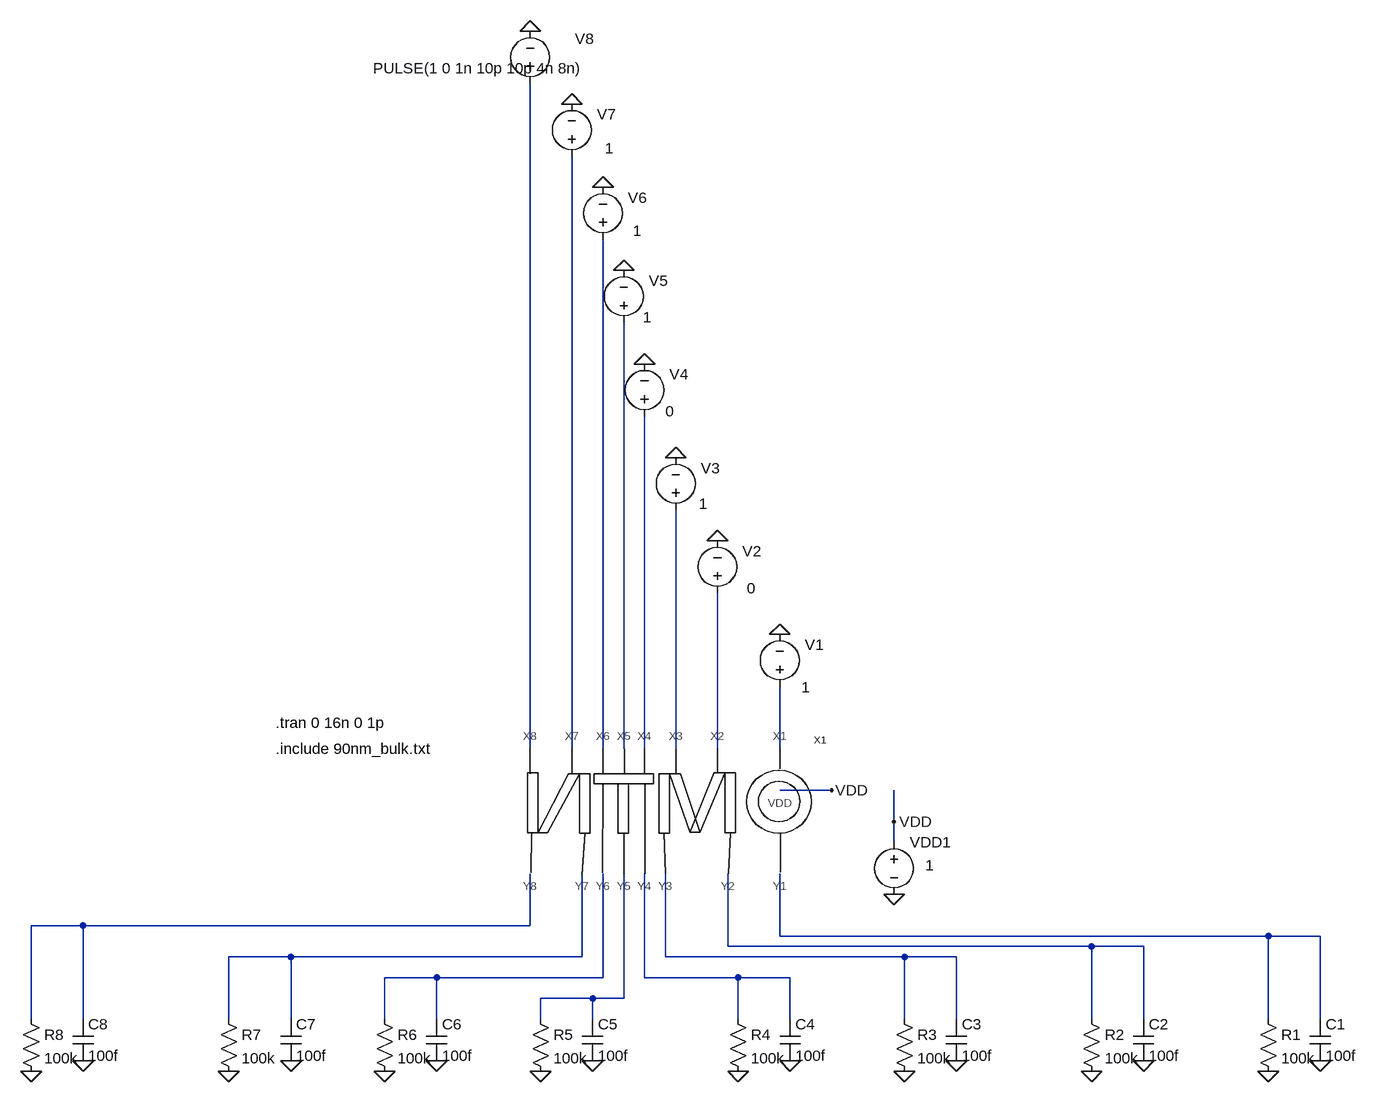
[diagram p0: schematic BCD_2_BIN_test.asc]
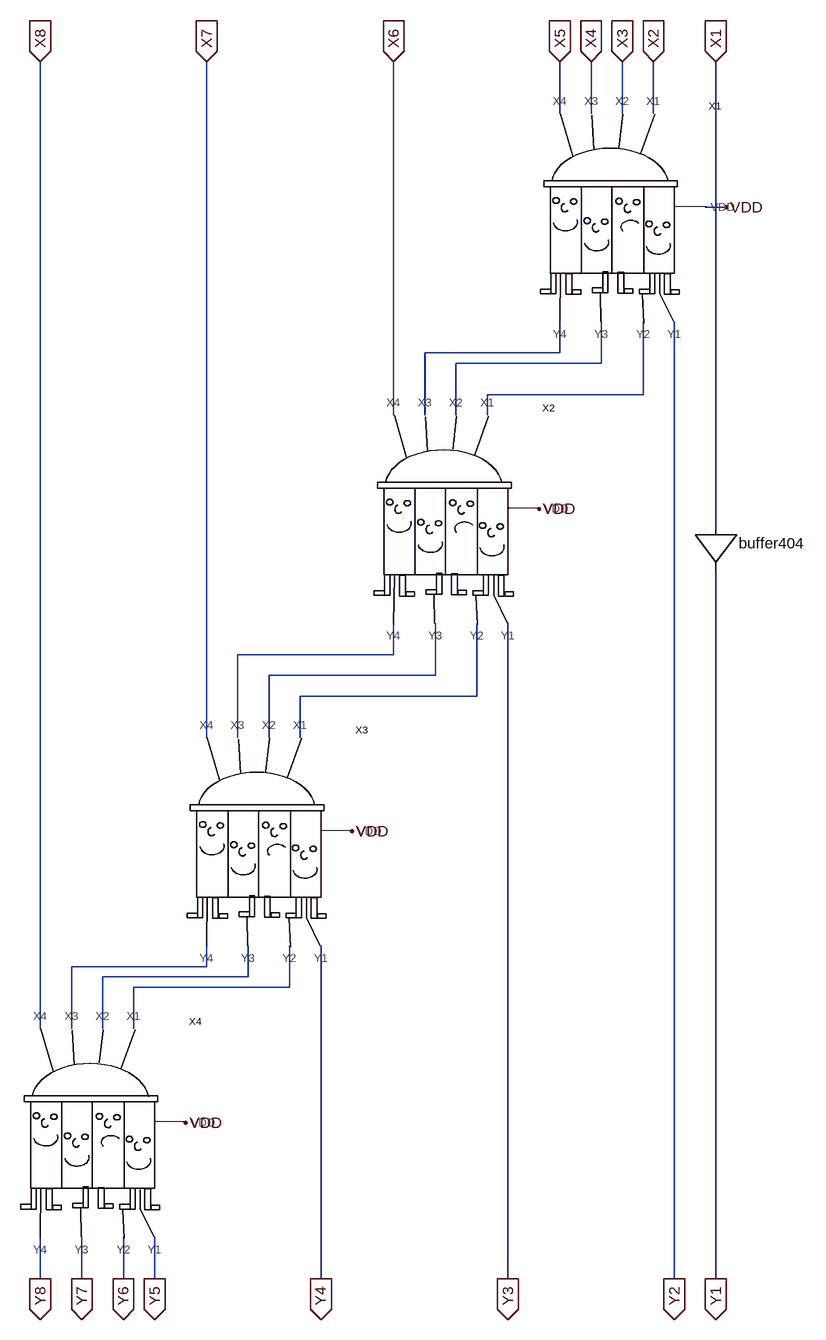
[diagram p1: sub-circuit bcd_2_bin.asc]
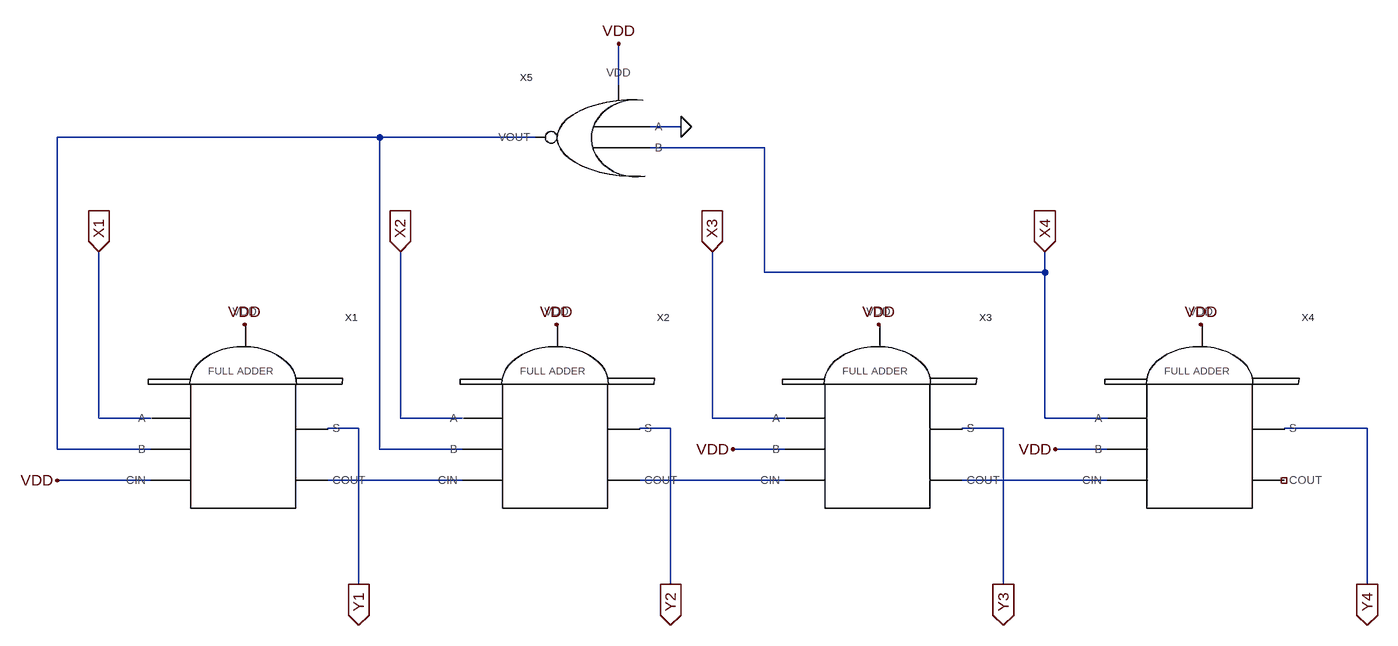
[diagram p2: sub-circuit func_block.asc]
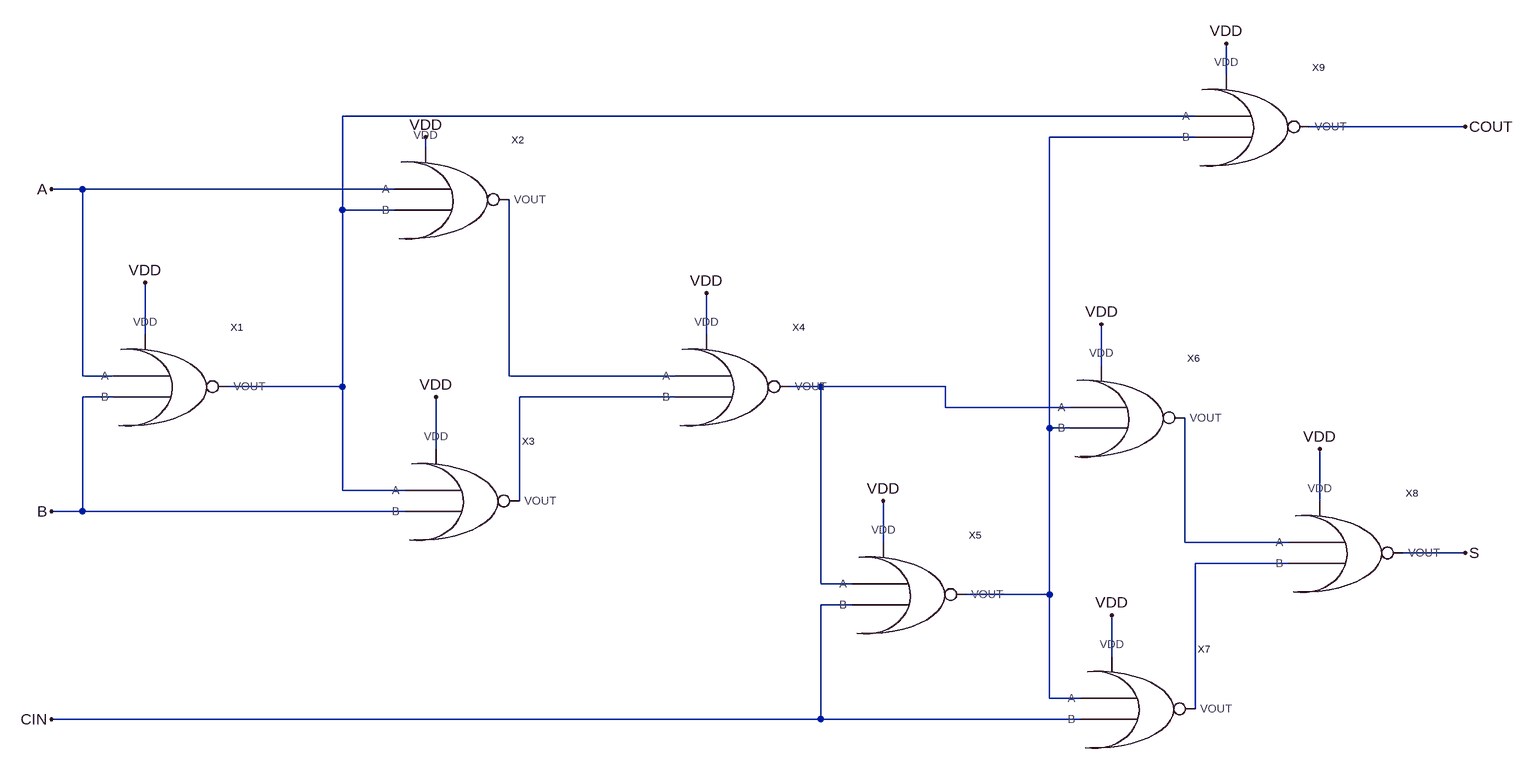
[diagram p3: sub-circuit adder.asc]
BCD_2_BIN_test.asc, the LTspice schematic file:
Version 4
SHEET 1 1356 980
WIRE 80 96 80 -928
WIRE 144 96 144 -816
WIRE 192 96 192 -688
WIRE 224 96 224 -560
WIRE 256 96 256 -416
WIRE 304 96 304 -272
WIRE 368 96 368 -144
WIRE 464 96 464 0
WIRE 544 160 464 160
WIRE 640 208 640 160
WIRE 640 240 640 208
WIRE -608 368 -688 368
WIRE 80 368 80 288
WIRE 80 368 -608 368
WIRE 464 384 464 288
WIRE 1216 384 464 384
WIRE 1296 384 1216 384
WIRE 384 400 384 288
WIRE 944 400 384 400
WIRE 1024 400 944 400
WIRE -288 416 -384 416
WIRE 160 416 160 288
WIRE 160 416 -288 416
WIRE 288 416 288 288
WIRE 656 416 288 416
WIRE 736 416 656 416
WIRE -64 448 -144 448
WIRE 192 448 192 288
WIRE 192 448 -64 448
WIRE 256 448 256 288
WIRE 400 448 256 448
WIRE 480 448 400 448
WIRE 176 480 96 480
WIRE 224 480 224 288
WIRE 224 480 176 480
WIRE -688 512 -688 368
WIRE -608 512 -608 368
WIRE -384 512 -384 416
WIRE -288 512 -288 416
WIRE -144 512 -144 448
WIRE -64 512 -64 448
WIRE 96 512 96 480
WIRE 176 512 176 480
WIRE 400 512 400 448
WIRE 480 512 480 448
WIRE 656 512 656 416
WIRE 736 512 736 416
WIRE 944 512 944 400
WIRE 1024 512 1024 400
WIRE 1216 512 1216 384
WIRE 1296 512 1296 384
FLAG 640 320 0
FLAG 640 208 VDD
FLAG 1296 576 0
FLAG 1216 592 0
FLAG 1024 576 0
FLAG 944 592 0
FLAG 736 576 0
FLAG 656 592 0
FLAG 480 576 0
FLAG 400 592 0
FLAG 176 576 0
FLAG 96 592 0
FLAG -64 576 0
FLAG -144 592 0
FLAG -288 576 0
FLAG -384 592 0
FLAG -608 576 0
FLAG -688 592 0
FLAG 464 -80 0
FLAG 368 -224 0
FLAG 304 -352 0
FLAG 256 -496 0
FLAG 224 -640 0
FLAG 192 -768 0
FLAG 144 -896 0
FLAG 80 -1008 0
FLAG 544 160 VDD
SYMBOL voltage 640 224 R0
WINDOW 3 48 51 Left 2
WINDOW 123 0 0 Left 0
WINDOW 39 0 0 Left 0
SYMATTR Value 1
SYMATTR InstName VDD1
SYMBOL BCD_2_BIN 272 176 R0
SYMATTR InstName X1
SYMBOL res 1200 496 R0
SYMATTR InstName R1
SYMATTR Value 100k
SYMBOL res 928 496 R0
SYMATTR InstName R2
SYMATTR Value 100k
SYMBOL res 640 496 R0
SYMATTR InstName R3
SYMATTR Value 100k
SYMBOL res 384 496 R0
SYMATTR InstName R4
SYMATTR Value 100k
SYMBOL res 80 496 R0
SYMATTR InstName R5
SYMATTR Value 100k
SYMBOL res -160 496 R0
SYMATTR InstName R6
SYMATTR Value 100k
SYMBOL res -400 496 R0
SYMATTR InstName R7
SYMATTR Value 100k
SYMBOL res -704 496 R0
SYMATTR InstName R8
SYMATTR Value 100k
SYMBOL cap 1280 512 R0
SYMATTR InstName C1
SYMATTR Value 100f
SYMBOL cap 1008 512 R0
SYMATTR InstName C2
SYMATTR Value 100f
SYMBOL cap 720 512 R0
SYMATTR InstName C3
SYMATTR Value 100f
SYMBOL cap 464 512 R0
SYMATTR InstName C4
SYMATTR Value 100f
SYMBOL cap 160 512 R0
SYMATTR InstName C5
SYMATTR Value 100f
SYMBOL cap -80 512 R0
SYMATTR InstName C6
SYMATTR Value 100f
SYMBOL cap -304 512 R0
SYMATTR InstName C7
SYMATTR Value 100f
SYMBOL cap -624 512 R0
SYMATTR InstName C8
SYMATTR Value 100f
SYMBOL voltage 464 16 R180
WINDOW 0 -68 80 Left 2
WINDOW 3 -47 15 Left 2
WINDOW 123 0 0 Left 0
WINDOW 39 0 0 Left 0
SYMATTR InstName V1
SYMATTR Value 1
SYMBOL voltage 368 -128 R180
WINDOW 0 -68 80 Left 2
WINDOW 3 -59 23 Left 2
WINDOW 123 0 0 Left 0
WINDOW 39 0 0 Left 0
SYMATTR InstName V2
SYMATTR Value 0
SYMBOL voltage 304 -256 R180
WINDOW 0 -68 80 Left 2
WINDOW 3 -49 25 Left 2
WINDOW 123 0 0 Left 0
WINDOW 39 0 0 Left 0
SYMATTR InstName V3
SYMATTR Value 1
SYMBOL voltage 256 -400 R180
WINDOW 0 -68 80 Left 2
WINDOW 3 -46 23 Left 2
WINDOW 123 0 0 Left 0
WINDOW 39 0 0 Left 0
SYMATTR InstName V4
SYMATTR Value 0
SYMBOL voltage 224 -544 R180
WINDOW 0 -68 80 Left 2
WINDOW 3 -43 24 Left 2
WINDOW 123 0 0 Left 0
WINDOW 39 0 0 Left 0
SYMATTR InstName V5
SYMATTR Value 1
SYMBOL voltage 192 -672 R180
WINDOW 0 -68 80 Left 2
WINDOW 3 -60 29 Left 2
WINDOW 123 0 0 Left 0
WINDOW 39 0 0 Left 0
SYMATTR InstName V6
SYMATTR Value 1
SYMBOL voltage 144 -800 R180
WINDOW 0 -68 80 Left 2
WINDOW 3 -65 28 Left 2
WINDOW 123 0 0 Left 0
WINDOW 39 0 0 Left 0
SYMATTR InstName V7
SYMATTR Value 1
SYMBOL voltage 80 -912 R180
WINDOW 0 -98 84 Left 2
WINDOW 3 -82 39 Left 2
WINDOW 123 0 0 Left 0
WINDOW 39 0 0 Left 0
SYMATTR InstName V8
SYMATTR Value PULSE(1 0 1n 10p 10p 4n 8n)
TEXT -312 96 Left 2 !.include 90nm_bulk.txt
TEXT -312 56 Left 2 !.tran 0 16n 0 1p

bcd_2_bin.asc, the sub-circuit schematic file:
Version 4
SHEET 1 1016 1516
WIRE 624 -432 624 -512
WIRE 672 -432 672 -512
WIRE 720 -432 720 -512
WIRE 768 -432 768 -512
WIRE 880 -288 848 -288
WIRE 624 -64 624 -112
WIRE 624 -64 416 -64
WIRE 688 -48 688 -112
WIRE 688 -48 464 -48
WIRE 752 0 752 -112
WIRE 752 0 512 0
WIRE 368 32 368 -512
WIRE 416 32 416 -64
WIRE 464 32 464 -48
WIRE 512 32 512 0
WIRE 864 208 864 -512
WIRE 368 400 368 352
WIRE 368 400 128 400
WIRE 432 432 432 352
WIRE 432 432 176 432
WIRE 496 464 496 352
WIRE 496 464 224 464
WIRE 80 528 80 -512
WIRE 128 528 128 400
WIRE 176 528 176 432
WIRE 224 528 224 464
WIRE 80 880 80 848
WIRE 80 880 -128 880
WIRE 144 896 144 848
WIRE 144 896 -80 896
WIRE 208 912 208 848
WIRE 208 912 -32 912
WIRE -176 976 -176 -512
WIRE -128 976 -128 880
WIRE -80 976 -80 896
WIRE -32 976 -32 912
WIRE -176 1360 -176 1296
WIRE -112 1360 -112 1296
WIRE -48 1360 -48 1296
WIRE 0 1360 0 1296
WIRE 256 1360 256 848
WIRE 544 1360 544 352
WIRE 800 1360 800 -112
WIRE 864 1360 864 272
FLAG 864 -512 X1
IOPIN 864 -512 In
FLAG 768 -512 X2
IOPIN 768 -512 In
FLAG 720 -512 X3
IOPIN 720 -512 In
FLAG 672 -512 X4
IOPIN 672 -512 In
FLAG 624 -512 X5
IOPIN 624 -512 In
FLAG 368 -512 X6
IOPIN 368 -512 In
FLAG 80 -512 X7
IOPIN 80 -512 In
FLAG -176 -512 X8
IOPIN -176 -512 In
FLAG 864 1360 Y1
IOPIN 864 1360 Out
FLAG 800 1360 Y2
IOPIN 800 1360 Out
FLAG 544 1360 Y3
IOPIN 544 1360 Out
FLAG 256 1360 Y4
IOPIN 256 1360 Out
FLAG 0 1360 Y5
IOPIN 0 1360 Out
FLAG -48 1360 Y6
IOPIN -48 1360 Out
FLAG -112 1360 Y7
IOPIN -112 1360 Out
FLAG -176 1360 Y8
IOPIN -176 1360 Out
FLAG 880 -288 VDD
FLAG 592 176 VDD
FLAG 304 672 VDD
FLAG 48 1120 VDD
SYMBOL FUNC_BLOCK 656 -256 R0
SYMATTR InstName X1
SYMBOL FUNC_BLOCK 400 208 R0
SYMATTR InstName X2
SYMBOL FUNC_BLOCK 112 704 R0
SYMATTR InstName X3
SYMBOL FUNC_BLOCK -144 1152 R0
SYMATTR InstName X4
SYMBOL Digital\\buf1 928 208 R90
WINDOW 0 21 -74 VRight 2
SYMATTR InstName buffer404

func_block.asc, the sub-circuit schematic file:
Version 4
SHEET 1 1608 680
WIRE 384 -624 384 -688
WIRE 480 -560 432 -560
WIRE 16 -544 -480 -544
WIRE 256 -544 16 -544
WIRE 608 -528 432 -528
WIRE 608 -336 608 -528
WIRE 1040 -336 1040 -368
WIRE 1040 -336 608 -336
WIRE -416 -112 -416 -368
WIRE -336 -112 -416 -112
WIRE 48 -112 48 -368
WIRE 144 -112 48 -112
WIRE 528 -112 528 -368
WIRE 640 -112 528 -112
WIRE 1040 -112 1040 -336
WIRE 1136 -112 1040 -112
WIRE -16 -96 -64 -96
WIRE 464 -96 416 -96
WIRE 976 -96 912 -96
WIRE 1536 -96 1408 -96
WIRE -480 -64 -480 -544
WIRE -336 -64 -480 -64
WIRE 16 -64 16 -544
WIRE 144 -64 16 -64
WIRE 640 -64 560 -64
WIRE 1136 -64 1056 -64
WIRE -336 -16 -480 -16
WIRE 144 -16 -64 -16
WIRE 640 -16 416 -16
WIRE 1136 -16 912 -16
WIRE -16 144 -16 -96
WIRE 464 144 464 -96
WIRE 976 144 976 -96
WIRE 1536 144 1536 -96
FLAG -480 -16 VDD
FLAG 560 -64 VDD
FLAG 1056 -64 VDD
FLAG -416 -368 X1
IOPIN -416 -368 In
FLAG 48 -368 X2
IOPIN 48 -368 In
FLAG 528 -368 X3
IOPIN 528 -368 In
FLAG 1040 -368 X4
IOPIN 1040 -368 In
FLAG -16 144 Y1
IOPIN -16 144 Out
FLAG 464 144 Y2
IOPIN 464 144 Out
FLAG 976 144 Y3
IOPIN 976 144 Out
FLAG 1536 144 Y4
IOPIN 1536 144 Out
FLAG 480 -560 0
FLAG 384 -688 VDD
FLAG -192 -256 VDD
FLAG 288 -256 VDD
FLAG 784 -256 VDD
FLAG 1280 -256 VDD
SYMBOL ADDER -192 -64 R0
SYMATTR InstName X1
SYMBOL ADDER 288 -64 R0
SYMATTR InstName X2
SYMBOL ADDER 784 -64 R0
SYMATTR InstName X3
SYMBOL ADDER 1280 -64 R0
SYMATTR InstName X4
SYMBOL NOR 432 -544 M0
SYMATTR InstName X5

adder.asc, the sub-circuit schematic file:
Version 4
SHEET 1 1864 832
WIRE 1408 -240 1408 -288
WIRE 1360 -176 48 -176
WIRE 1776 -160 1536 -160
WIRE 1360 -144 1136 -144
WIRE 176 -128 176 -144
WIRE -352 -64 -400 -64
WIRE 128 -64 -352 -64
WIRE 48 -32 48 -176
WIRE 128 -32 48 -32
WIRE -256 160 -256 80
WIRE 608 160 608 96
WIRE 1216 208 1216 144
WIRE -352 224 -352 -64
WIRE -304 224 -352 224
WIRE 304 224 304 -48
WIRE 560 224 304 224
WIRE 48 240 48 -32
WIRE 48 240 -128 240
WIRE 784 240 736 240
WIRE 976 240 784 240
WIRE -304 256 -352 256
WIRE 560 256 320 256
WIRE 976 272 976 240
WIRE 1168 272 976 272
WIRE 1136 304 1136 -144
WIRE 1168 304 1136 304
WIRE 192 336 192 256
WIRE 48 400 48 240
WIRE 144 400 48 400
WIRE 320 416 320 256
WIRE 1552 416 1552 336
WIRE -352 432 -352 256
WIRE -352 432 -400 432
WIRE 144 432 -352 432
WIRE 880 480 880 416
WIRE 1344 480 1344 288
WIRE 1504 480 1344 480
WIRE 1776 496 1680 496
WIRE 1504 512 1360 512
WIRE 784 544 784 240
WIRE 832 544 784 544
WIRE 1136 560 1136 304
WIRE 1136 560 1008 560
WIRE 832 576 784 576
WIRE 1232 656 1232 592
WIRE 1136 720 1136 560
WIRE 1184 720 1136 720
WIRE 1360 736 1360 512
WIRE 784 752 784 576
WIRE 784 752 -400 752
WIRE 1184 752 784 752
FLAG -256 80 VDD
FLAG 608 96 VDD
FLAG 176 -144 VDD
FLAG 192 256 VDD
FLAG 880 416 VDD
FLAG 1216 144 VDD
FLAG 1408 -288 VDD
FLAG 1552 336 VDD
FLAG 1232 592 VDD
FLAG 1776 496 S
FLAG 1776 -160 COUT
FLAG -400 -64 A
FLAG -400 432 B
FLAG -400 752 CIN
SYMBOL NOR -304 240 R0
SYMATTR InstName X1
SYMBOL NOR 128 -48 R0
SYMATTR InstName X2
SYMBOL NOR 144 416 R0
SYMATTR InstName X3
SYMBOL NOR 560 240 R0
SYMATTR InstName X4
SYMBOL NOR 832 560 R0
SYMATTR InstName X5
SYMBOL NOR 1168 288 R0
SYMATTR InstName X6
SYMBOL NOR 1184 736 R0
SYMATTR InstName X7
SYMBOL NOR 1504 496 R0
SYMATTR InstName X8
SYMBOL NOR 1360 -160 R0
SYMATTR InstName X9

The netlist it stands for:
* BCD_2_BIN_test.asc
VDD1 VDD 0 1
XX1 N008 N007 N006 N005 N004 N003 N002 N001 N010 N011 N013 N015 N016 N014 N012 N009 VDD bcd_2_bin
R1 N010 0 100k
R2 N011 0 100k
R3 N013 0 100k
R4 N015 0 100k
R5 N016 0 100k
R6 N014 0 100k
R7 N012 0 100k
R8 N009 0 100k
C1 N010 0 100f
C2 N011 0 100f
C3 N013 0 100f
C4 N015 0 100f
C5 N016 0 100f
C6 N014 0 100f
C7 N012 0 100f
C8 N009 0 100f
V1 N008 0 1
V2 N007 0 0
V3 N006 0 1
V4 N005 0 0
V5 N004 0 1
V6 N003 0 1
V7 N002 0 1
V8 N001 0 PULSE(1 0 1n 10p 10p 4n 8n)

* block symbol definitions
.subckt bcd_2_bin X1 X2 X3 X4 X5 X6 X7 X8 Y1 Y2 Y3 Y4 Y5 Y6 Y7 Y8 VDD
XX1 X5 X4 X3 X2 N001 N002 N003 Y2 VDD func_block
XX2 X6 N001 N002 N003 N004 N005 N006 Y3 VDD func_block
XX3 X7 N004 N005 N006 N007 N008 N009 Y4 VDD func_block
XX4 X8 N007 N008 N009 Y8 Y7 Y6 Y5 VDD func_block
A§buffer404 X1 0 0 0 0 0 Y1 0 BUF
.ends bcd_2_bin

.subckt func_block X4 X3 X2 X1 Y4 Y3 Y2 Y1 VDD
XX1 X1 N001 VDD N002 Y1 VDD adder
XX2 X2 N001 N002 N003 Y2 VDD adder
XX3 X3 VDD N003 N004 Y3 VDD adder
XX4 X4 VDD N004 NC_01 Y4 VDD adder
XX5 0 X4 N001 VDD NOR  ; pins A B VOUT VDD
.ends func_block

.subckt adder A B CIN COUT S VDD
XX1 A B N001 VDD NOR  ; pins A B VOUT VDD
XX2 A N001 N003 VDD NOR  ; pins A B VOUT VDD
XX3 N001 B N005 VDD NOR  ; pins A B VOUT VDD
XX4 N003 N005 N004 VDD NOR  ; pins A B VOUT VDD
XX5 N004 CIN N002 VDD NOR  ; pins A B VOUT VDD
XX6 N004 N002 N006 VDD NOR  ; pins A B VOUT VDD
XX7 N002 CIN N007 VDD NOR  ; pins A B VOUT VDD
XX8 N006 N007 S VDD NOR  ; pins A B VOUT VDD
XX9 N001 N002 COUT VDD NOR  ; pins A B VOUT VDD
.ends adder

.include 90nm_bulk.txt
.tran 0 16n 0 1p
.backanno
.end